# EasyEDA schematic SCH_Type-c-Hub_2024-10-24.json
TITLE: Sheet_1; REV: 1.0; Date: 2024-10-23; Sheet: 1/1; Drawn By: huntervtharp1018; Company: Your Company
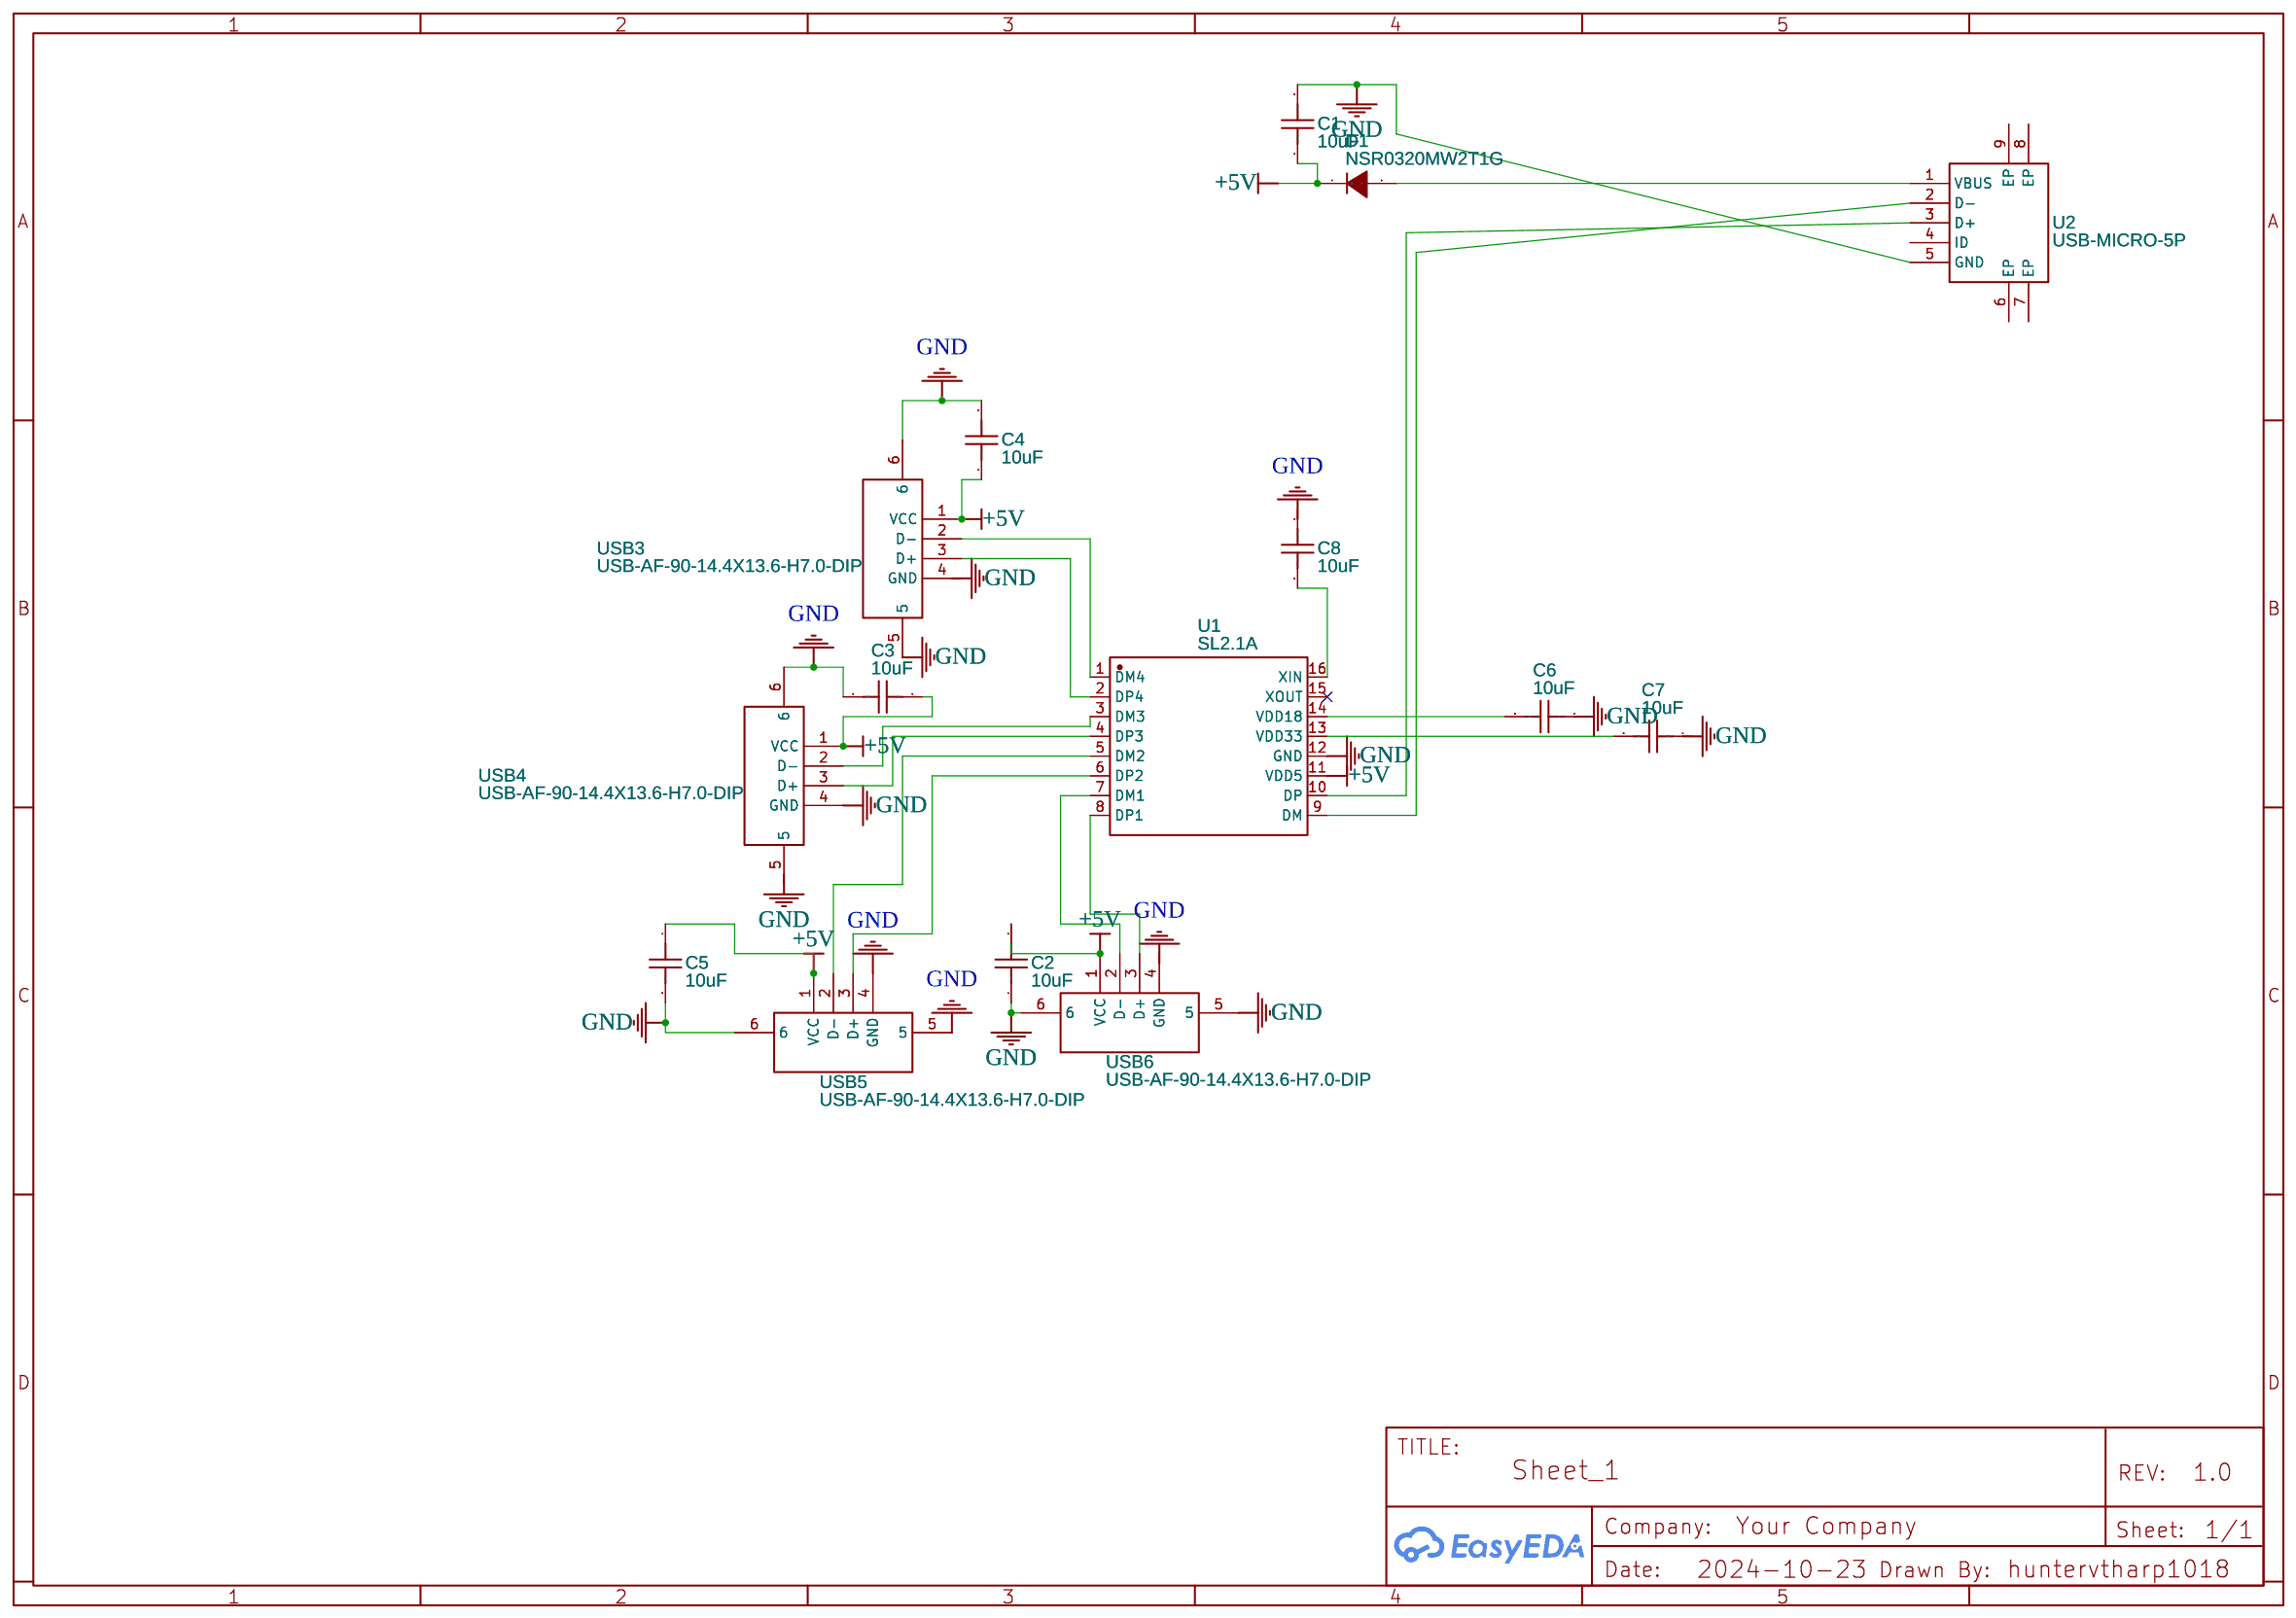
[diagram p0: schematic sheet]

## Parts
C1  10uF  [C0603]
C2  10uF  [C0603]
C3  10uF  [C0603]
C4  10uF  [C0603]
C5  10uF  [C0603]
C6  10uF  [C0603]
C7  10uF  [C0603]
C8  10uF  [C0603]
D1  NSR0320MW2T1G  [SOD-323_L1.8-W1.3-LS2.5-RD]
U1  SL2.1A  [SOP-16_L10.0-W3.9-P1.27-LS6.0-BL]
U2  USB-MICRO-5P  [MICRO-USB-SMD_MICRO-USB-A9]
USB3  USB-AF-90-14.4X13.6-H7.0-DIP  [USB-A-TH_C46407]
USB4  USB-AF-90-14.4X13.6-H7.0-DIP  [USB-A-TH_C46407]
USB5  USB-AF-90-14.4X13.6-H7.0-DIP  [USB-A-TH_C46407]
USB6  USB-AF-90-14.4X13.6-H7.0-DIP  [USB-A-TH_C46407]

## Library data of the parts
C1-C8 = CL10A106KP8NNNC: Supplier: LCSC; Manufacturer: SAMSUNG(三星); Supplier Part: C19702; JLCPCB Part Class: Basic Part
D1 = NSR0320MW2T1G: Supplier: LCSC; Manufacturer: onsemi(安森美); Supplier Part: C48192; JLCPCB Part Class: Extended Part
U1 = SL2.1A: Contributor: LCSC; Supplier: LCSC; Supplier Part: C192893; Manufacturer: CoreChips(和芯润德); JLCPCB Part Class: Extended Part
U2 = USB-MICRO-5P: Contributor: lcsc; Supplier: LCSC; Supplier Part: C9900014288; Manufacturer: null; Manufacturer Part: USB-Micro-5P; JLCPCB Part Class: Extended Part
USB3-USB6 = USB-AF-90-14.4X13.6-H7.0-DIP: Contributor: LCSC; Supplier: LCSC; Supplier Part: C46407; Manufacturer: 精拓金; Manufacturer Part: 903-131A1011D10100; JLCPCB Part Class: Extended Part

## Nets
+5V: C1.1 C2.2 C3.1 C4.1 C5.1 D1.1(C) U1.11(VDD5) USB3.1(VCC) USB4.1(VCC) USB5.1(VCC) USB6.1(VCC)
GND: C1.2 C2.1 C3.2 C4.2 C5.2 U1.12(GND) U2.5(GND) USB3.5 USB3.6 USB4.4(GND) USB4.6 USB5.4(GND) USB5.5 USB5.6 USB6.5 USB6.6
Net-(C6-2): C6.2 U1.14(VDD18)
Net-(C7-2): C7.2 U1.13(VDD33)
Net-(C8-2): C8.2 U1.16(XIN)
Net-(D1-2): D1.2(A) U2.1(VBUS)
Net-(U1-1): U1.1(DM4) USB3.2(D-)
Net-(U1-2): U1.2(DP4) USB3.3(D+)
Net-(U1-3): U1.3(DM3) USB4.2(D-)
Net-(U1-4): U1.4(DP3) USB4.3(D+)
Net-(U1-5): U1.5(DM2) USB5.2(D-)
Net-(U1-6): U1.6(DP2) USB5.3(D+)
Net-(U1-7): U1.7(DM1) USB6.2(D-)
Net-(U1-8): U1.8(DP1) USB6.3(D+)
Net-(U1-9): U1.9(DM) U2.2(D-)
Net-(U1-10): U1.10(DP) U2.3(D+)

Not connected (* = marked no-connect by the designer): C6 1; C7 1; C8 1; U1 15(XOUT)*; U2 4(ID) 6(EP) 7(EP) 8(EP) 9(EP); USB3 4(GND); USB4 5; USB6 4(GND)
